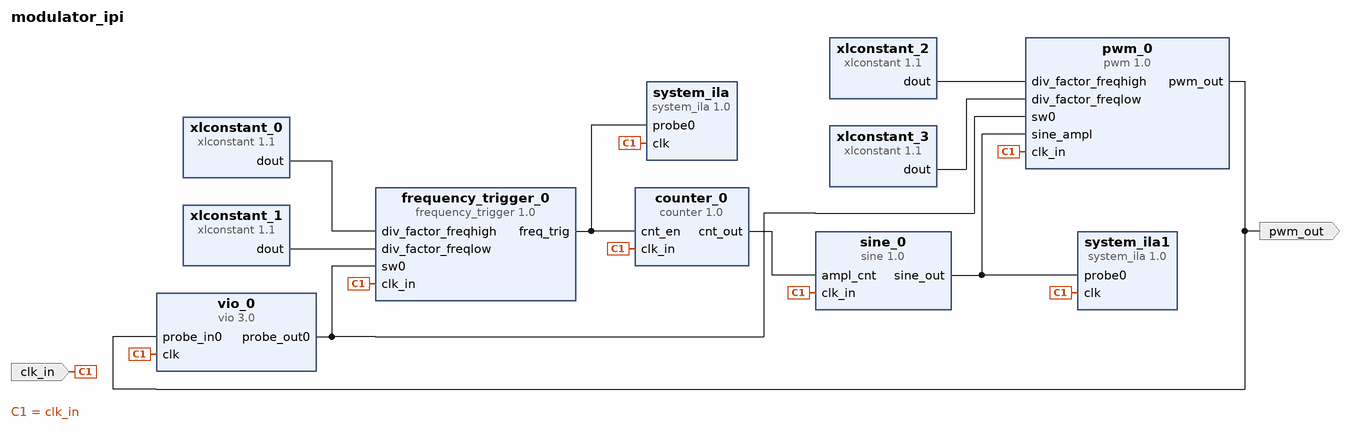
[diagram p0: block diagram of the top level]
# Vivado block design modulator_ipi, xc7z020clg484-1, Vivado 2016.4
create_bd_design modulator_ipi

create_bd_port -dir I clk_in
create_bd_port -dir O pwm_out

create_bd_cell -type ip -vlnv VSI-Logic:modulator:frequency_trigger:1.0 frequency_trigger_0
create_bd_cell -type ip -vlnv VSI-Logic:modulator:counter:1.0 counter_0
set_property -dict {CONFIG.cnt_value_p 0x0FF CONFIG.depth_p 0x008} [get_bd_cells counter_0]
create_bd_cell -type ip -vlnv VSI-Logic:modulator:sine:1.0 sine_0
set_property -dict {CONFIG.depth_p 0x008 CONFIG.width_p 0x00C} [get_bd_cells sine_0]
create_bd_cell -type ip -vlnv VSI-Logic:modulator:pwm:1.0 pwm_0
set_property -dict {CONFIG.width_p 0x00C} [get_bd_cells pwm_0]
create_bd_cell -type ip -vlnv xilinx.com:ip:xlconstant:1.1 xlconstant_0
set_property -dict {CONFIG.CONST_WIDTH 32 CONFIG.CONST_VAL 110592} [get_bd_cells xlconstant_0]
create_bd_cell -type ip -vlnv xilinx.com:ip:xlconstant:1.1 xlconstant_1
set_property -dict {CONFIG.CONST_WIDTH 32 CONFIG.CONST_VAL 389120} [get_bd_cells xlconstant_1]
create_bd_cell -type ip -vlnv xilinx.com:ip:xlconstant:1.1 xlconstant_2
set_property -dict {CONFIG.CONST_WIDTH 32 CONFIG.CONST_VAL 27} [get_bd_cells xlconstant_2]
create_bd_cell -type ip -vlnv xilinx.com:ip:xlconstant:1.1 xlconstant_3
set_property -dict {CONFIG.CONST_WIDTH 32 CONFIG.CONST_VAL 95} [get_bd_cells xlconstant_3]
create_bd_cell -type ip -vlnv xilinx.com:ip:vio:3.0 vio_0
create_bd_cell -type ip -vlnv xilinx.com:ip:system_ila:1.0 system_ila
set_property -dict {CONFIG.C_PROBE0_TYPE 0 CONFIG.C_NUM_OF_PROBES 1 CONFIG.C_MON_TYPE NATIVE} [get_bd_cells system_ila]
create_bd_cell -type ip -vlnv xilinx.com:ip:system_ila:1.0 system_ila1
set_property -dict {CONFIG.C_PROBE0_TYPE 0 CONFIG.C_NUM_OF_PROBES 1 CONFIG.C_MON_TYPE NATIVE} [get_bd_cells system_ila1]

# ---- connections ----

connect_bd_net [get_bd_ports clk_in] \
  [get_bd_pins frequency_trigger_0/clk_in] [get_bd_pins counter_0/clk_in] [get_bd_pins sine_0/clk_in] \
  [get_bd_pins pwm_0/clk_in] [get_bd_pins vio_0/clk] [get_bd_pins system_ila/clk] [get_bd_pins system_ila1/clk]
connect_bd_net -net sw0_1 [get_bd_pins vio_0/probe_out0] [get_bd_pins frequency_trigger_0/sw0] [get_bd_pins pwm_0/sw0]
connect_bd_net [get_bd_pins pwm_0/pwm_out] [get_bd_ports pwm_out] [get_bd_pins vio_0/probe_in0]
connect_bd_net [get_bd_pins xlconstant_0/dout] [get_bd_pins frequency_trigger_0/div_factor_freqhigh]
connect_bd_net [get_bd_pins xlconstant_1/dout] [get_bd_pins frequency_trigger_0/div_factor_freqlow]
connect_bd_net [get_bd_pins xlconstant_2/dout] [get_bd_pins pwm_0/div_factor_freqhigh]
connect_bd_net [get_bd_pins xlconstant_3/dout] [get_bd_pins pwm_0/div_factor_freqlow]
connect_bd_net [get_bd_pins frequency_trigger_0/freq_trig] [get_bd_pins counter_0/cnt_en] [get_bd_pins system_ila/probe0]
connect_bd_net [get_bd_pins counter_0/cnt_out] [get_bd_pins sine_0/ampl_cnt]
connect_bd_net [get_bd_pins sine_0/sine_out] [get_bd_pins pwm_0/sine_ampl] [get_bd_pins system_ila1/probe0]

validate_bd_design
save_bd_design
